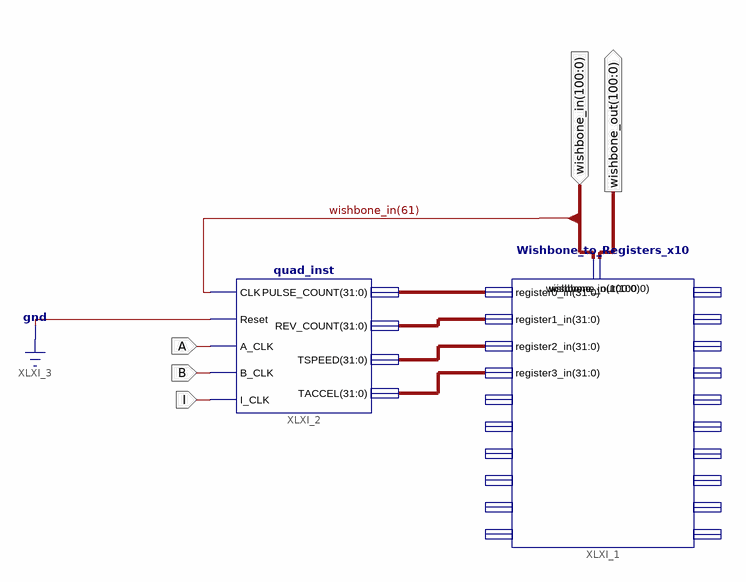
[diagram p0: schematic sheet 1]
// Xilinx ISE schematic RCL_Quadrature_Decoder.sch (spartan6) as structural Verilog: 2 symbols, 5 ports
module RCL_Quadrature_Decoder (
  input  [100:0] wishbone_in,
  input  A,
  input  B,
  input  I,
  output [100:0] wishbone_out
);

  wire [31:0] XLXN_3, XLXN_4, XLXN_5, XLXN_6;

  Wishbone_to_Registers_x10 XLXI_1 (
    .register0_in(XLXN_3), .register1_in(XLXN_4), .register2_in(XLXN_5), .register3_in(XLXN_6),
    .wishbone_in(wishbone_in), .wishbone_out(wishbone_out));  // open: register4_in, register5_in, register6_in, register7_in, register8_in, register9_in, register0_out, register1_out, register2_out, register3_out, register4_out, register5_out, register6_out, register7_out, register8_out, register9_out
  quad_inst XLXI_2 (
    .CLK(wishbone_in[61]), .Reset(1'b0), .A_CLK(A), .B_CLK(B), .I_CLK(I), .PULSE_COUNT(XLXN_3),
    .REV_COUNT(XLXN_4), .TSPEED(XLXN_5), .TACCEL(XLXN_6));
endmodule
